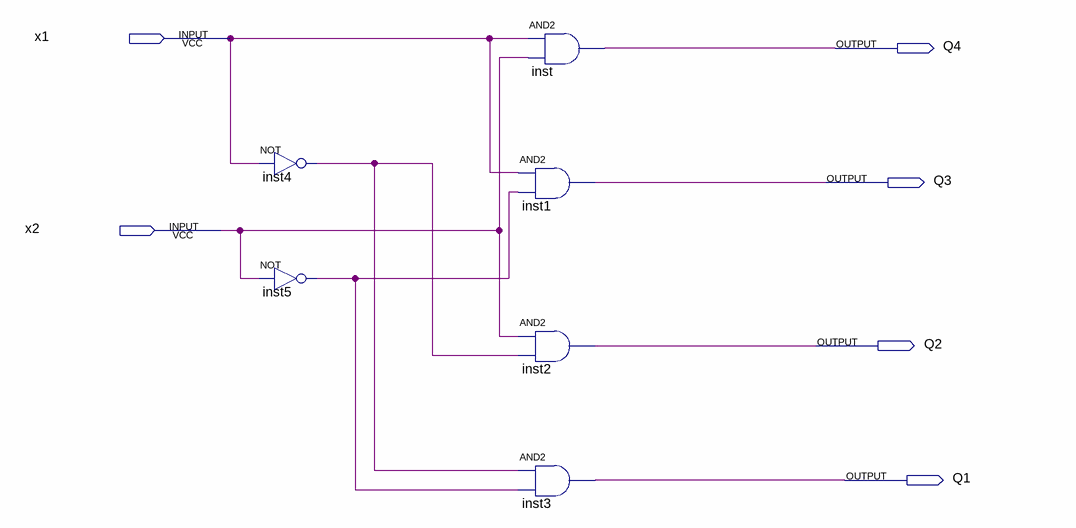
[diagram p0: schematic sheet]
// Quartus schematic decoder2to4.bdf as structural Verilog: 6 symbols, 6 pins
module decoder2to4 (
  input  x1,
  input  x2,
  output Q4,
  output Q3,
  output Q2,
  output Q1
);

  wire inst4_out, inst5_out;

  not inst4 (inst4_out, x1);
  not inst5 (inst5_out, x2);
  and inst1 (Q3, x1, inst5_out);
  and inst2 (Q2, x2, inst4_out);
  and inst3 (Q1, inst4_out, inst5_out);
  and inst (Q4, x1, x2);
endmodule
